# EAGLE schematic Magileff_transporter (EAGLE 7.0.0)
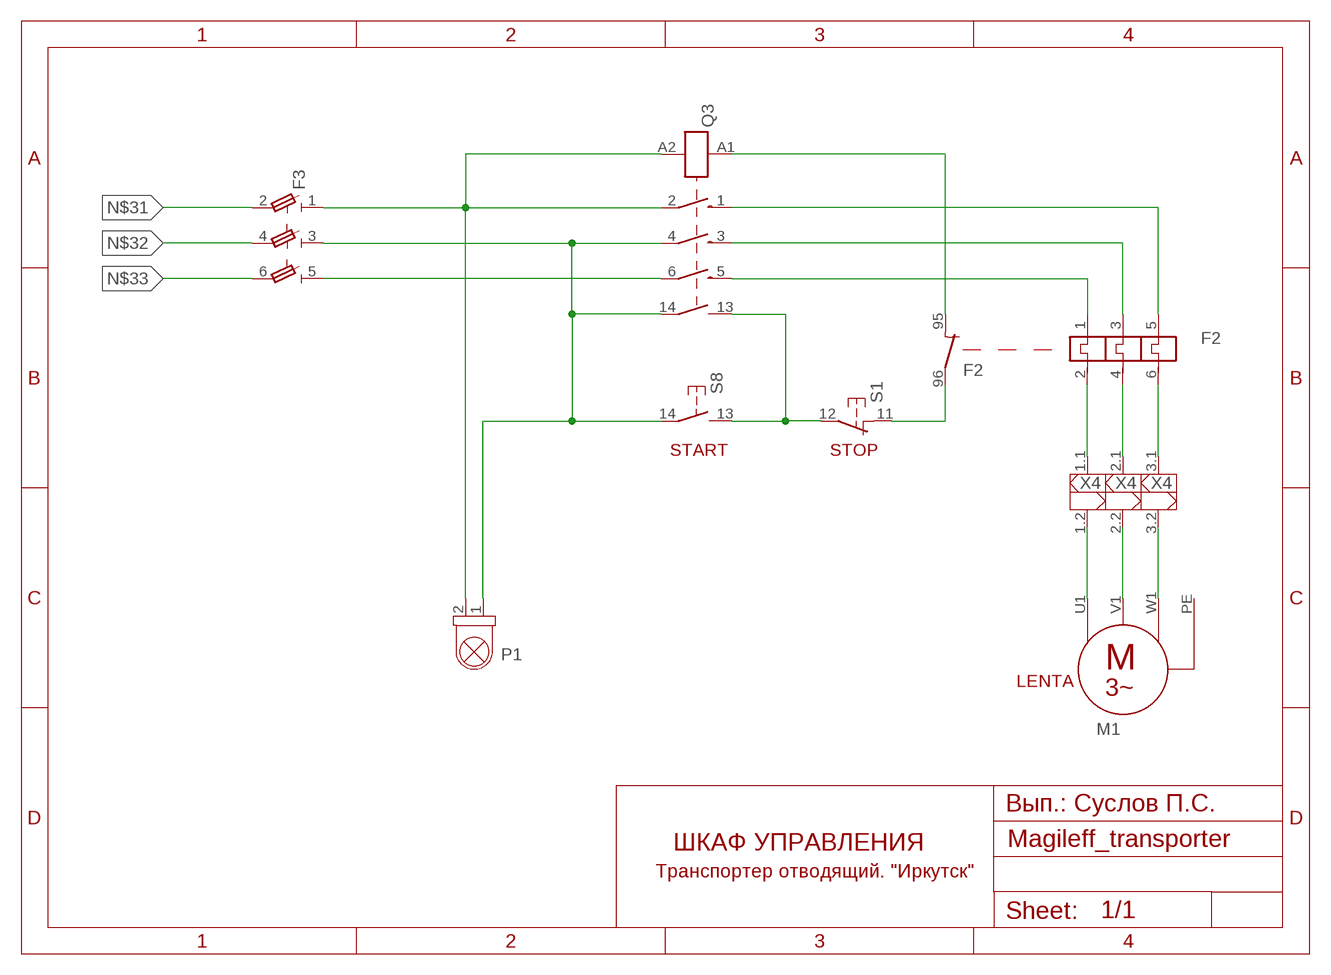
[diagram p0: schematic, sheet 1]

## Parts
F2  MOTORSCHUTZSCHALTER_3-POL_THERM_AUSLOESUNG_HILFSKONTAKTE  [MOTORSCHUTZSCHALTER_3-POL_THERM_AUSLOESUNG_HILFSKONTAKT_95_96_97_98]
F3  TRENNSICHERUNG_3-POL  [TRENNSICHERUNG_3-POL]
M1  MOTOR_3-POL_PE  [MOTOR_3-POL_PE]
P1  BLINK/BLITZLEUCHTE  [LAMPE]
Q3  HAUPTSCHUETZ_3-POL_HILFSKONTAKT_13-14_OHNE_KONTAKTSPIEGEL  [HAUPTSCHUETZ_3-POL+HILFSKONTAKT_13-14_OHNE_KONTAKTSPIEGEL]
S1  OEFFNER_TASTSCHALTER  [OEFFNER_TASTSCHALTER]
S8  SCHLIESSER_TASTSCHALTER  [SCHLIESSER_TASTSCHALTER]
X4  KLEMME-2_3-BRUECKE  [KLEMME-2_3-BRUECKE]

## Nets
A: F3.1 P1.2(X2) Q3.2 Q3.A2
B: F3.3 P1.1(X1) Q3.4 Q3.14 S8.14
C: F3.5 Q3.6
N$12: Q3.13 S1.12 S8.13
N$13: F2.96 S1.11
N$20: M1.U1 X4.1.2
N$21: M1.V1 X4.2.2
N$22: M1.W1 X4.3.2
N$23: F2.6 X4.3.1
N$24: F2.4 X4.2.1
N$25: F2.2 X4.1.1
N$27: F2.5 Q3.1
N$28: F2.3 Q3.3
N$29: F2.1 Q3.5
N$31: F3.2
N$32: F3.4
N$33: F3.6
N$34: F2.95 Q3.A1
Unconnected: F2.97 F2.98 M1.PE

## Notes on the sheet
- START | STOP
- LENTA
- Вып.: Суслов П.С.
- ШКАФ УПРАВЛЕНИЯ
- Транспортер отводящий. "Иркутск"

## Library data of the parts
F2 = e-motorschutzschalter:MOTORSCHUTZSCHALTER_3-POL_THERM_AUSLOESUNG_HILFSKONTAKTE: Motorschutzschalter 3-pol. mit thermischer Auslösung, Hilfskontakte
F3 = e-sicherungen:TRENNSICHERUNG_3-POL: Sicherungstrennschalter, 3-pol.
M1 = e-motoren:MOTOR_3-POL_PE: 3-Phasen-Motor mit PE
P1 = e-lampen-signalisation:BLINK/BLITZLEUCHTE: Blink-, Blitzleuchte
Q3 = e-schuetze-relais:HAUPTSCHUETZ_3-POL_HILFSKONTAKT_13-14_OHNE_KONTAKTSPIEGEL: Hauptschütz, 3-pol. mit Hilfskontakt-Schließer ohne Kontaktspiegel
S1 = e-schalter:OEFFNER_TASTSCHALTER: Tastschalter, Öffner
S8 = e-schalter:SCHLIESSER_TASTSCHALTER: Tastschalter, Schließer
X4 = e-klemmen:KLEMME-2_3-BRUECKE: Klemme 3-pol. mit Brückenhinweis